# Altium project can-bus-shield-arduino.PrjPcb
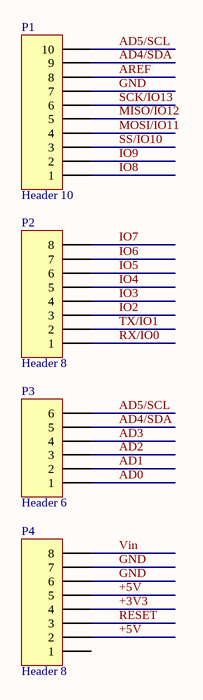
[diagram p0: io.SchDoc]
1 sheet, 4 parts. Net scope: global (net labels, ports and power ports of the same name join across sheets).
Board file: arduino_shield.PcbDoc

## Sheet io.SchDoc
size A

### Parts
P1  Header 10  [HDR1X10]
P2  Header 8  [HDR1X8]
P3  Header 6  [HDR1X6]
P4  Header 8  [HDR1X8]

### Nets
+3V3: P4.4
+5V: P4.2 P4.5
AD0: P3.1
AD1: P3.2
AD2: P3.3
AD3: P3.4
AD4/SDA: P1.9 P3.5
AD5/SCL: P1.10 P3.6
AREF: P1.8
GND: P1.7 P4.6 P4.7
IO2: P2.3
IO3: P2.4
IO4: P2.5
IO5: P2.6
IO6: P2.7
IO7: P2.8
IO8: P1.1
IO9: P1.2
MISO/IO12: P1.5
MOSI/IO11: P1.4
RESET: P4.3
RX/IO0: P2.1
SCK/IO13: P1.6
SS/IO10: P1.3
TX/IO1: P2.2
Vin: P4.8

Not connected (* = marked no-connect by the designer): P4 1

### Library data of the parts
P1 = Header 10: Header, 10-Pin; LatestRevisionDate: 17-Jul-2002; LatestRevisionNote: Re-released for DXP Platform.; Publisher: Altium Limited
P2 P4 = Header 8: Header, 8-Pin; LatestRevisionDate: 17-Jul-2002; LatestRevisionNote: Re-released for DXP Platform.; Publisher: Altium Limited
P3 = Header 6: Header, 6-Pin; LatestRevisionDate: 17-Jul-2002; LatestRevisionNote: Re-released for DXP Platform.; Publisher: Altium Limited